# EAGLE schematic Leaf (EAGLE 6.1)
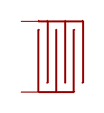
[diagram p0: schematic, sheet 1]

## Parts
U$1  LEAF  [LEAF]
Unconnected: U$1.1 U$1.2

## Library data of the parts
U$1 = mark_1:LEAF